# Altium project hexbot_bluetooth.PrjPcb
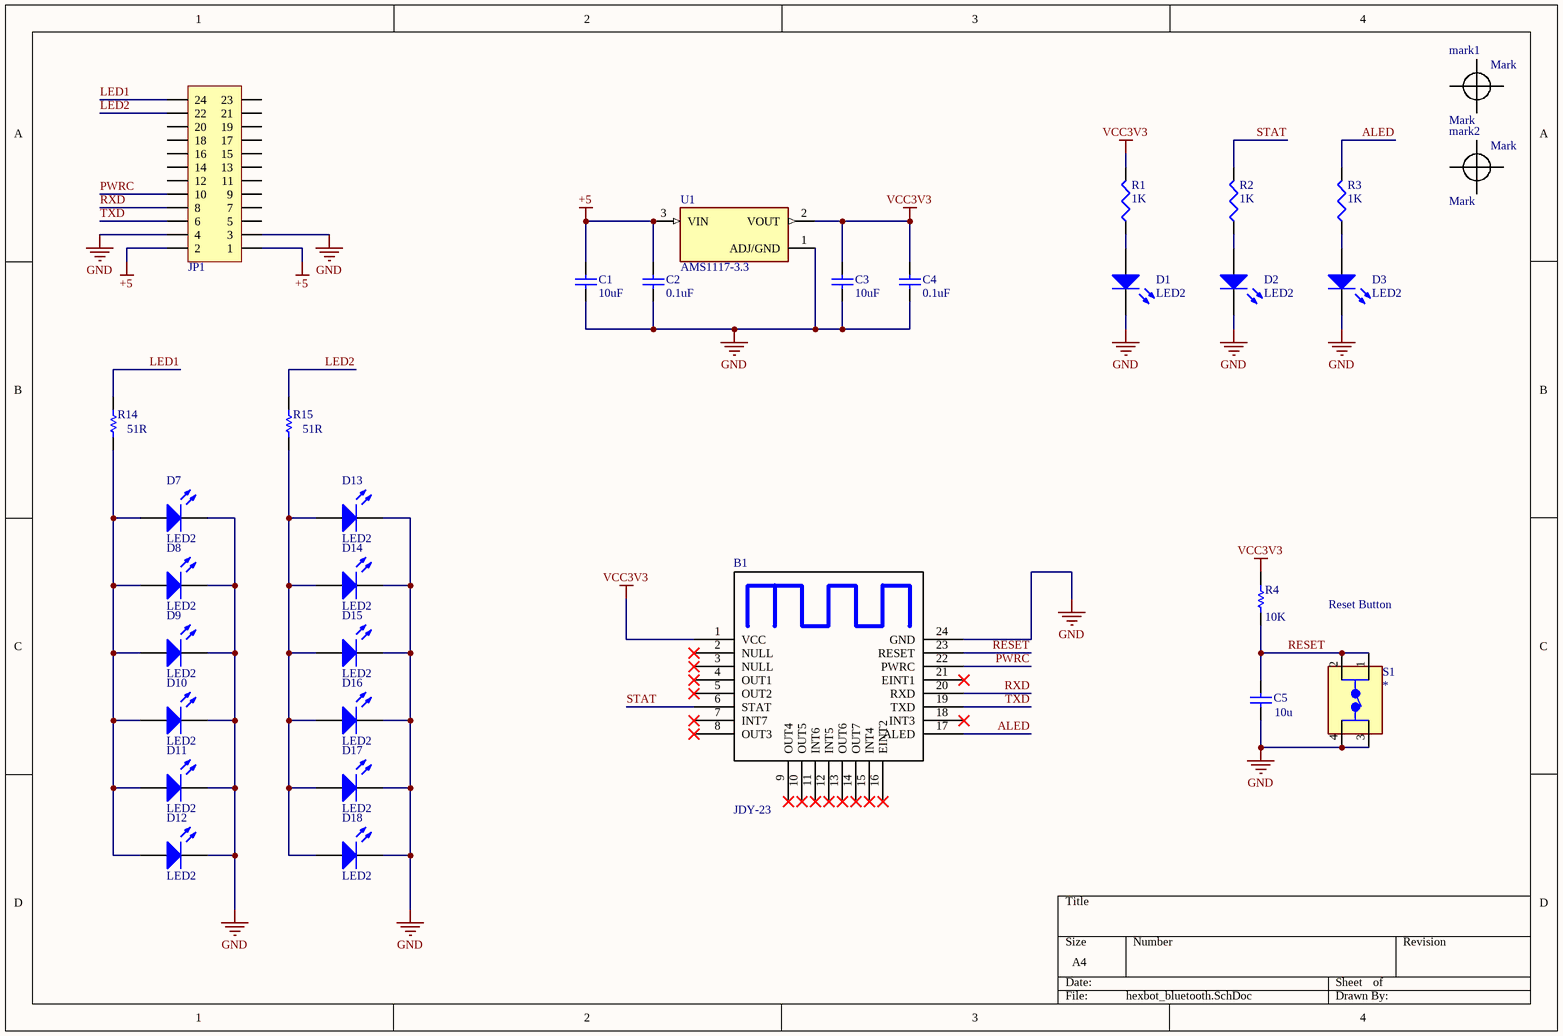
[diagram p0: hexbot_bluetooth.SchDoc]
1 sheet, 32 parts. Net scope: global (net labels, ports and power ports of the same name join across sheets).
Board file: hexbot_bluetooth.PcbDoc

## Sheet hexbot_bluetooth.SchDoc
size A4

### Parts
B1  JDY-23  [BlueTooth_JDY-23]
C1  10uF  [1608[0603]]
C2  0.1uF  [1608[0603]]
C3  10uF  [1608[0603]]
C4  0.1uF  [1608[0603]]
C5  value 10u  [1608[0603]]  (hidden comment: Cap Semi)
D1  LED2  [DIOC1005X06N]
D2  LED2  [DIOC1005X06N]
D3  LED2  [DIOC1005X06N]
D7  LED2  [DIOC1005X06N]
D8  LED2  [DIOC1005X06N]
D9  LED2  [DIOC1005X06N]
D10  LED2  [DIOC1005X06N]
D11  LED2  [DIOC1005X06N]
D12  LED2  [DIOC1005X06N]
D13  LED2  [DIOC1005X06N]
D14  LED2  [DIOC1005X06N]
D15  LED2  [DIOC1005X06N]
D16  LED2  [DIOC1005X06N]
D17  LED2  [DIOC1005X06N]
D18  LED2  [DIOC1005X06N]
JP1  Header 2X11  [HDR2.54-WI-2x12P]  (value not drawn)
mark1  Mark  [Mark]  (no BOM)
mark2  Mark  [Mark]  (no BOM)
R1  1K  [1608[0603]]
R2  1K  [1608[0603]]
R3  1K  [1608[0603]]
R4  value 10K  [1608[0603]]  (hidden comment: Res1)
R14  51R  [1608[0603]]
R15  51R  [1608[0603]]
S1  4-1437565-1  [TE_FSM4JSMA]  (value not drawn)
U1  AMS1117-3.3  [SOT-223-4_L6.5-W3.5-P2.30-LS7.0-BR]

### Nets
+5: C1.2 C2.2 JP1.1 JP1.2 U1.3(VIN)
GND: B1.24(GND) C1.1 C2.1 C3.1 C4.1 C5.1 D1.2(K) D2.2(K) D3.2(K) D7.2(K) D8.2(K) D9.2(K) D10.2(K) D11.2(K) D12.2(K) D13.2(K) D14.2(K) D15.2(K) D16.2(K) D17.2(K) D18.2(K) JP1.3 JP1.4 S1.3 S1.4 U1.1(ADJ/GND)
VCC3V3: B1.1(VCC) C3.2 C4.2 R1.2 R4.2 U1.2(VOUT)
ALED: B1.17(ALED) R3.2
LED1: JP1.24 R14.2
LED2: JP1.22 R15.2
PWRC: B1.22(PWRC) JP1.10
RESET: B1.23(RESET) C5.2 R4.1 S1.1 S1.2
RXD: B1.20(RXD) JP1.8
STAT: B1.6(STAT) R2.2
TXD: B1.19(TXD) JP1.6
NetD1_1: D1.1(A) R1.1
NetD2_1: D2.1(A) R2.1
NetD3_1: D3.1(A) R3.1
NetD7_1: D7.1(A) D8.1(A) D9.1(A) D10.1(A) D11.1(A) D12.1(A) R14.1
NetD13_1: D13.1(A) D14.1(A) D15.1(A) D16.1(A) D17.1(A) D18.1(A) R15.1

Not connected (* = marked no-connect by the designer): B1 2(NULL)* 3(NULL)* 4(OUT1)* 5(OUT2)* 7(INT7)* 8(OUT3)* 9(OUT4)* 10(OUT5)* 11(INT6)* 12(INT5)* 13(OUT6)* 14(OUT7)* 15(INT4)* 16(EINT2)* 18(INT3)* 21(EINT1)*; JP1 5 7 9 11 12 13 14 15 16 17 18 19 20 21 23

### Notes on the sheet
- Reset Button

### Library data of the parts
B1 = BlueTooth
C1-C5 = Cap Semi: Capacitor (Semiconductor SIM Model); Published: 8-Jun-2000; LatestRevisionDate: 29-May-2009; LatestRevisionNote: IPC-7351 Footprint Added.; PackageReference: C1206; Publisher: Altium Limited; PackageDescription: Chip Capacitor
D1-D3 D7-D18 = LED2: Typical RED, GREEN, YELLOW, AMBER GaAs LED; Published: 8-Jun-2000; LatestRevisionDate: 17-Jul-2002; LatestRevisionNote: Re-released for DXP Platform.; PackageVersion: Feb-2002; PackageReference: 3.2X1.6X1.1; Publisher: Altium Limited; PackageDescription: SM LED; 2 Flat Leads
JP1 = Header 12X2: 12*2P接插件; 版权归属: 封装库来自淘宝卖家 ID：黄晶宝石; BOM名称: 12*2P接插件; 学习资源: https://shop463601444.taobao.com
R1-R3 = Res3: Resistor; Published: 8-Jun-2000; LatestRevisionDate: 29-May-2009; LatestRevisionNote: IPC-7351 Footprint Added.; PackageReference: J1-0603; Publisher: Altium Limited; PackageDescription: Chip Resistor
R4 R14 R15 = Res1: Resistor; Published: 8-Jun-2000; LatestRevisionDate: 17-Jul-2002; LatestRevisionNote: Re-released for DXP Platform.; PackageReference: AXIAL-0.3; Publisher: Altium Limited; PackageDescription: Axial Device, Thru-Hole; 2 Leads; 0.3 in Pin Spacing
S1 = FSM4JSMA: Tactile Switch SPST-NO Top Actuated Surface Mount; Contact_Current_Rating: 50 mA; Configuration_Pole-Throw: Single Pole - Single Throw; MF: TE Connectivity; SnapEDA_Link: https://www.snapeda.com/parts/FSM4JSMA/TE%20Connectivity%20ALCOSWITCH%20Switches/view-part/543632/?ref=snap; Availability: Unavailable; TE_purchase_URL: https://www.te.com/usa-en/product-4-1437565-1.html?te_bu=Cor&te_type=disp&te_campaign=seda_glo_cor-seda-global-disp-prtnr-fy19-seda-model-bom-cta_sma-317_1&elqCampaignId=32493; MP: FSM4JSMA; EU_RoHS_Compliance: Compliant; Price: None; Value: *; Package: None; Comment_1: *
U1 = AMS1117-3.3: Sot223/Pkg 1-Amp 3.3-Volt Low Drop Out Voltage Regulatator; MF: Advanced Monolithic Systems; Price: None; Package: None; Value: *; MP: AMS1117-3.3; Availability: Unavailable; SnapEDA_Link: https://www.snapeda.com/parts/AMS1117-3.3/Advanced%20Monolithic%20Systems/view-part/53450/?ref=snap